# Altium schematic sheet config-bank8.SchDoc: Config FPGA - Bank 8
size Legal; CheckedBy: J. Brinton; CompanyName: Signal Laboratories, Inc.; DrawnBy: J. Brinton; Engineer: J. Brinton; Address1: 3479 Edison Way; Address2: Menlo Park CA 94025; Address3: +1 (877) 778-8435; Address4: siglabs.com; DocumentNumber: 19; Revision: 2b; SheetNumber: 20; SheetTotal: 58
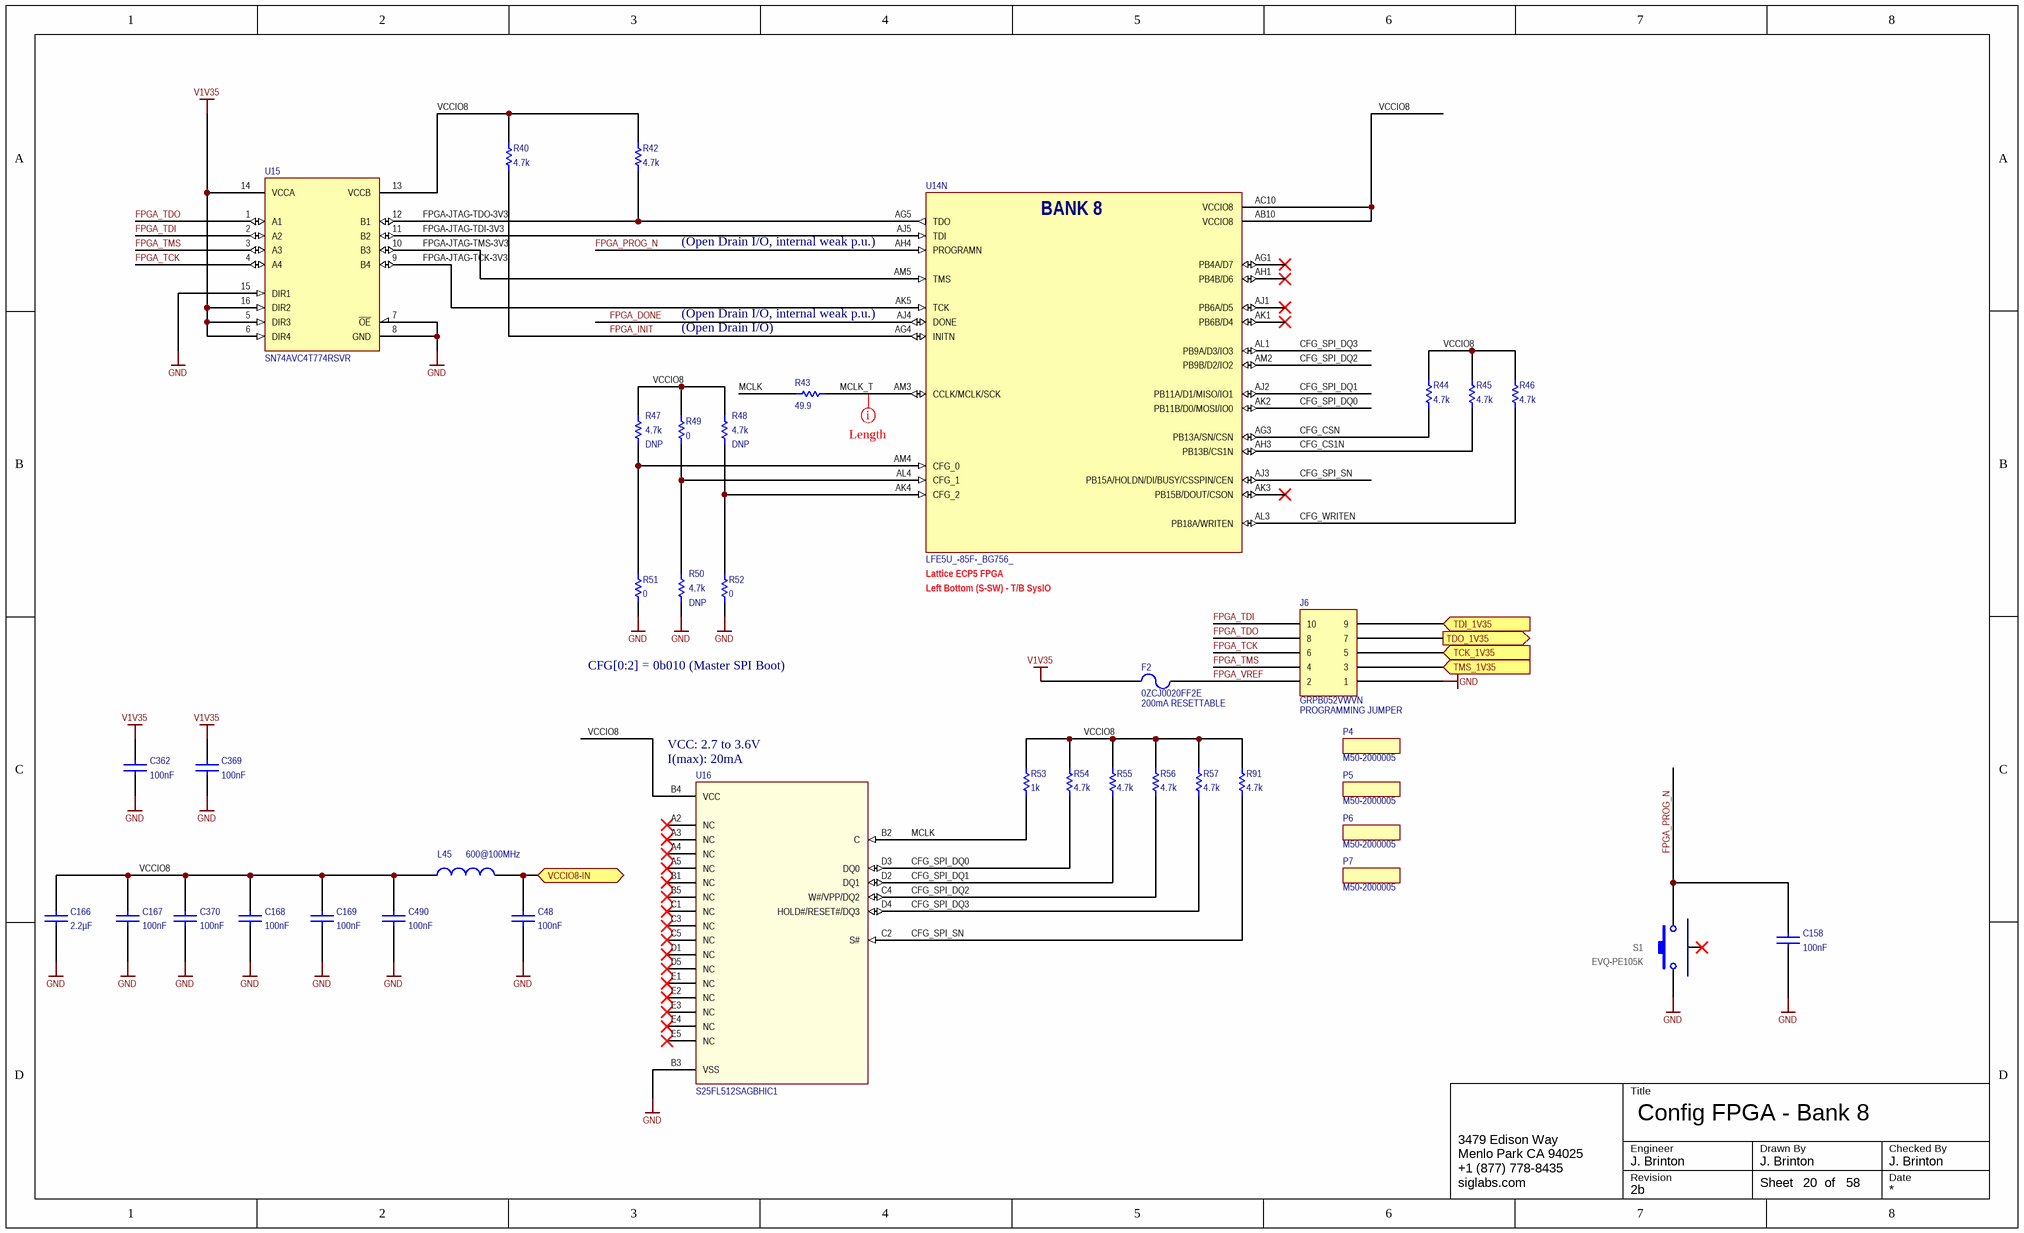
[diagram p0: config-bank8.SchDoc]

## Parts
C48  value 100nF  [CAPC1005X56N]  (hidden comment: GRM155R71C104KA88J)
C158  value 100nF  [CAPC1005X56N]  (hidden comment: GRM155R71C104KA88J)
C166  value 2.2µF  [CAPC1608X90N]  (hidden comment: GRM21BR71C225KA12L)
C167  value 100nF  [CAPC1005X56N]  (hidden comment: GRM155R71C104KA88J)
C168  value 100nF  [CAPC1005X56N]  (hidden comment: GRM155R71C104KA88J)
C169  value 100nF  [CAPC1005X56N]  (hidden comment: GRM155R71C104KA88J)
C362  value 100nF  [CAPC1005X56N]  (hidden comment: GRM155R71C104KA88J)
C369  value 100nF  [CAPC1005X56N]  (hidden comment: GRM155R71C104KA88J)
C370  value 100nF  [CAPC1005X56N]  (hidden comment: GRM155R71C104KA88J)
C490  value 100nF  [CAPC1005X56N]  (hidden comment: GRM155R71C104KA88J)
F2  0ZCJ0020FF2E  [1206]
J6  GRPB052VWVN  [GRPB052VWVN]
L45  value 600@100MHz  [0402]  (hidden comment: BLM15PX601SN1D)
P4  M50-2000005  (mechanical)
P5  M50-2000005  (mechanical)
P6  M50-2000005  (mechanical)
P7  M50-2000005  (mechanical)
R40  value 4.7k  [0603]  (hidden comment: ERJ3EKF4701V)
R42  value 4.7k  [0603]  (hidden comment: ERJ3EKF4701V)
R43  value 49.9  [0603]  (hidden comment: ERJ-3EKF49R9V)
R44  value 4.7k  [0603]  (hidden comment: ERJ3EKF4701V)
R45  value 4.7k  [0603]  (hidden comment: ERJ3EKF4701V)
R46  value 4.7k  [0603]  (hidden comment: ERJ3EKF4701V)
R47  value 4.7k  Do Not Place: DNP  [0603]  (hidden comment: ERJ3EKF4701V)
R48  value 4.7k  Do Not Place: DNP  [0603]  (hidden comment: ERJ3EKF4701V)
R49  value 0  [0603]  (hidden comment: ERJ-3GEY0R00V)
R50  value 4.7k  Do Not Place: DNP  [0603]  (hidden comment: ERJ3EKF4701V)
R51  value 0  [0603]  (hidden comment: ERJ-3GEY0R00V)
R52  value 0  [0603]  (hidden comment: ERJ-3GEY0R00V)
R53  value 1k  [0402]  (hidden comment: RC0402FR-071KL)
R54  value 4.7k  [0603]  (hidden comment: ERJ3EKF4701V)
R55  value 4.7k  [0603]  (hidden comment: ERJ3EKF4701V)
R56  value 4.7k  [0603]  (hidden comment: ERJ3EKF4701V)
R57  value 4.7k  [0603]  (hidden comment: ERJ3EKF4701V)
R91  value 4.7k  [0603]  (hidden comment: ERJ3EKF4701V)
S1  EVQ-PE105K  [EVQ-PE105K]
U14  LFE5U_-85F-_BG756_  [caBGA756]  (part N of 19)
U15  SN74AVC4T774RSVR  [RSV]
U16  S25FL512SAGBHIC1

## Ports
TCK_1V35 (in), TDI_1V35 (in), TDO_1V35 (out), TMS_1V35 (in), VCCIO8-IN

## Nets
GND: C48.1 C158.1 C166.1 C167.1 C168.1 C169.1 C362.1 C369.1 C370.1 C490.1 J6.1 R50.1 R51.1 R52.1 S1.1 U15.7(~{OE}) U15.8(GND) U15.15(DIR1) U16.B3(VSS)
V1V35: C362.2 C369.2 F2.1 U15.5(DIR3) U15.6(DIR4) U15.14(VCCA) U15.16(DIR2)
CFG_CS1N: R45.1 U14.AH3(PB13B/CS1N)
CFG_CSN: R44.1 U14.AG3(PB13A/SN/CSN)
CFG_SPI_DQ0: R54.1 U14.AK2(PB11B/D0/MOSI/IO0) U16.D3(DQ0)
CFG_SPI_DQ1: R55.1 U14.AJ2(PB11A/D1/MISO/IO1) U16.D2(DQ1)
CFG_SPI_DQ2: R56.1 U14.AM2(PB9B/D2/IO2) U16.C4(W#/VPP/DQ2)
CFG_SPI_DQ3: R57.1 U14.AL1(PB9A/D3/IO3) U16.D4(HOLD#/RESET#/DQ3)
CFG_SPI_SN: R91.1 U14.AJ3(PB15A/HOLDN/DI/BUSY/CSSPIN/CEN) U16.C2(S#)
CFG_WRITEN: R46.1 U14.AL3(PB18A/WRITEN)
FPGA-JTAG-TCK-3V3: U14.AK5(TCK) U15.9(B4)
FPGA-JTAG-TDI-3V3: U14.AJ5(TDI) U15.11(B2)
FPGA-JTAG-TDO-3V3: R42.1 U14.AG5(TDO) U15.12(B1)
FPGA-JTAG-TMS-3V3: U14.AM5(TMS) U15.10(B3)
FPGA_DONE: U14.AJ4(DONE)
FPGA_INIT: R40.1 U14.AG4(INITN)
FPGA_PROG_N: C158.2 S1.2 U14.AH4(PROGRAMN)
FPGA_TCK: J6.6 U15.4(A4)
FPGA_TDI: J6.10 U15.2(A2)
FPGA_TDO: J6.8 U15.1(A1)
FPGA_TMS: J6.4 U15.3(A3)
FPGA_VREF: F2.2 J6.2
MCLK: R43.2 R53.1 U16.B2(C)
MCLK_T: R43.1 U14.AM3(CCLK/MCLK/SCK)
TCK_1V35: J6.5 ; port TCK_1V35
TDI_1V35: J6.9 ; port TDI_1V35
TDO_1V35: J6.7 ; port TDO_1V35
TMS_1V35: J6.3 ; port TMS_1V35
VCCIO8: C166.2 C167.2 C168.2 C169.2 C370.2 C490.2 L45.2 R40.2 R42.2 R44.2 R45.2 R46.2 R47.2 R48.2 R49.2 R53.2 R54.2 R55.2 R56.2 R57.2 R91.2 U14.AB10(VCCIO8) U14.AC10(VCCIO8) U15.13(VCCB) U16.B4(VCC)
VCCIO8-IN: C48.2 L45.1 ; port VCCIO8-IN
NetR47_1: R47.1 R51.2 U14.AM4(CFG_0)
NetR48_1: R48.1 R52.2 U14.AK4(CFG_2)
NetR49_1: R49.1 R50.2 U14.AL4(CFG_1)

Not connected (* = marked no-connect by the designer): S1 3*; U14 AG1(PB4A/D7)* AH1(PB4B/D6)* AJ1(PB6A/D5)* AK1(PB6B/D4)* AK3(PB15B/DOUT/CSON)*; U16 A2(NC)* A3(NC)* A4(NC)* A5(NC)* B1(NC)* B5(NC)* C1(NC)* C3(NC)* C5(NC)* D1(NC)* D5(NC)* E1(NC)* E2(NC)* E3(NC)* E4(NC)* E5(NC)*

## Layout directives
rule Length Constraint [Min Length = 0mm    Max Length = 50.8mm]: MCLK_T

## Notes on the sheet
- (near U14) (Open Drain I/O, internal weak p.u.)
- (Open Drain I/O)
- Left Bottom (S-SW) - T/B SysIO
- (near U14) Lattice ECP5 FPGA
- CFG[0:2] = 0b010 (Master SPI Boot)
- (near U16) VCC: 2.7 to 3.6V
- (near F2) 200mA RESETTABLE
- PROGRAMMING JUMPER
- (near U16) I(max): 20mA
- Title
- Engineer
- Revision
- Drawn By
- Checked By
- Date
- Sheet
- of
- (in symbol LFE5U_-85F-_BG756_, part N) BANK 8

## Library data of the parts
C48 C158 C167-C169 C362 C369 C370 C490 = GRM155R71A104KA01J: Ceramic Capacitor 100nF ±10% 16V X7R 0402; Manufacturer: Murata; Tr: -55:125; Manufacturer P/N: GRM155R71C104KA88J; Tolerance: ±10%; Package: 0402; Voltage: 16V
C166 = GRM188R71A225KE15D: Ceramic Capacitor 2.2uF ±10% 10V X7R 0603; Manufacturer: Murata; Tr: -55:125; Manufacturer P/N: GRM188R71A225KE15D; Tolerance: ±10%; Package: 0603; Voltage: 10V
F2 = 0ZCJ0020FF2E: PTC Resettable Fuse, 0.2A, 30V, SMD 1206; Manufacturer: Bell Fuse; Manufacturer P/N: 0ZCJ0020FF2E; Package: 1206
J6 = GRPB052VWVN: Male Header, 0.050" Pitch, 2x5 Position; Manufacturer: Sullins; Manufacturer P/N: GRPB052VWVN
L45 = IND 0402: Ferrite Bead 600-Ohm @ 100MHz 900mA 0402; Manufacturer: Murata; Tolerance: ±25%; Tr: -55:125; Manufacturer P/N: BLM15PX601SN1D; Package: 0402
P4-P7 = M50-1900005: 1.27mm Jumper Socket; Manufacturer: Harwin; Manufacturer P/N: M50-1900005
R40 R42 R44-R48 R50 R54-R57 R91 = RES 0603 10k 1%: Thick Film Resistor 4.7k ±1% 0603; Manufacturer: Panasonic; Tr: -55:155; Tolerance: ±1%; Manufacturer P/N: ERJ3EKF4701V; Package: 0603
R43 = RES 0603 10k 1%: Thick Film Resistor 49.9 ±1% 0603; Manufacturer: Panasonic; Tr: -55:155; Tolerance: ±1%; Manufacturer P/N: ERJ-3EKF49R9V; Package: 0603
R49 R51 R52 = RES 0603 10k 1%: Thick Film Resistor Jumper 0603; Manufacturer: Panasonic; Tr: -55:155; Tolerance: 0; Manufacturer P/N: ERJ-3GEY0R00V; Package: 0603
R53 = RES 0603 10k 1%: Thick Film Resistor 1k ±1% 0402; Manufacturer: Yageo; Tr: -55:155; Tolerance: ±1%; Manufacturer P/N: RC0402FR-071KL; Footprint: 0603; Package: 0402
S1 = EVQ-PF006K: Tactile Switch; Normally Open; Manufacturer: Panasonic; Manufacturer P/N: EVQ-PE105K
U14 = LFE5U_-85F-_BG756_: ECP5 FPGA, 85k LUT, 756-caBGA; Manufacturer: Lattice Semiconductor; Manufacturer P/N: LFE5U_-85F-_BG756_
U15 = SN74AVC4T774RSVR: 4-Bit Dual-Supply Bus Transceiver; Manufacturer: Texas Instruments; Manufacturer P/N: SN74AVC4T774RSVR
U16 = N25Q00AA13G1240: 1024Mb, 3.3V Serial Flash Memory LBGA24; Manufacturer: Cypress; Manufacturer P/N: S25FL512SAGBHIC1